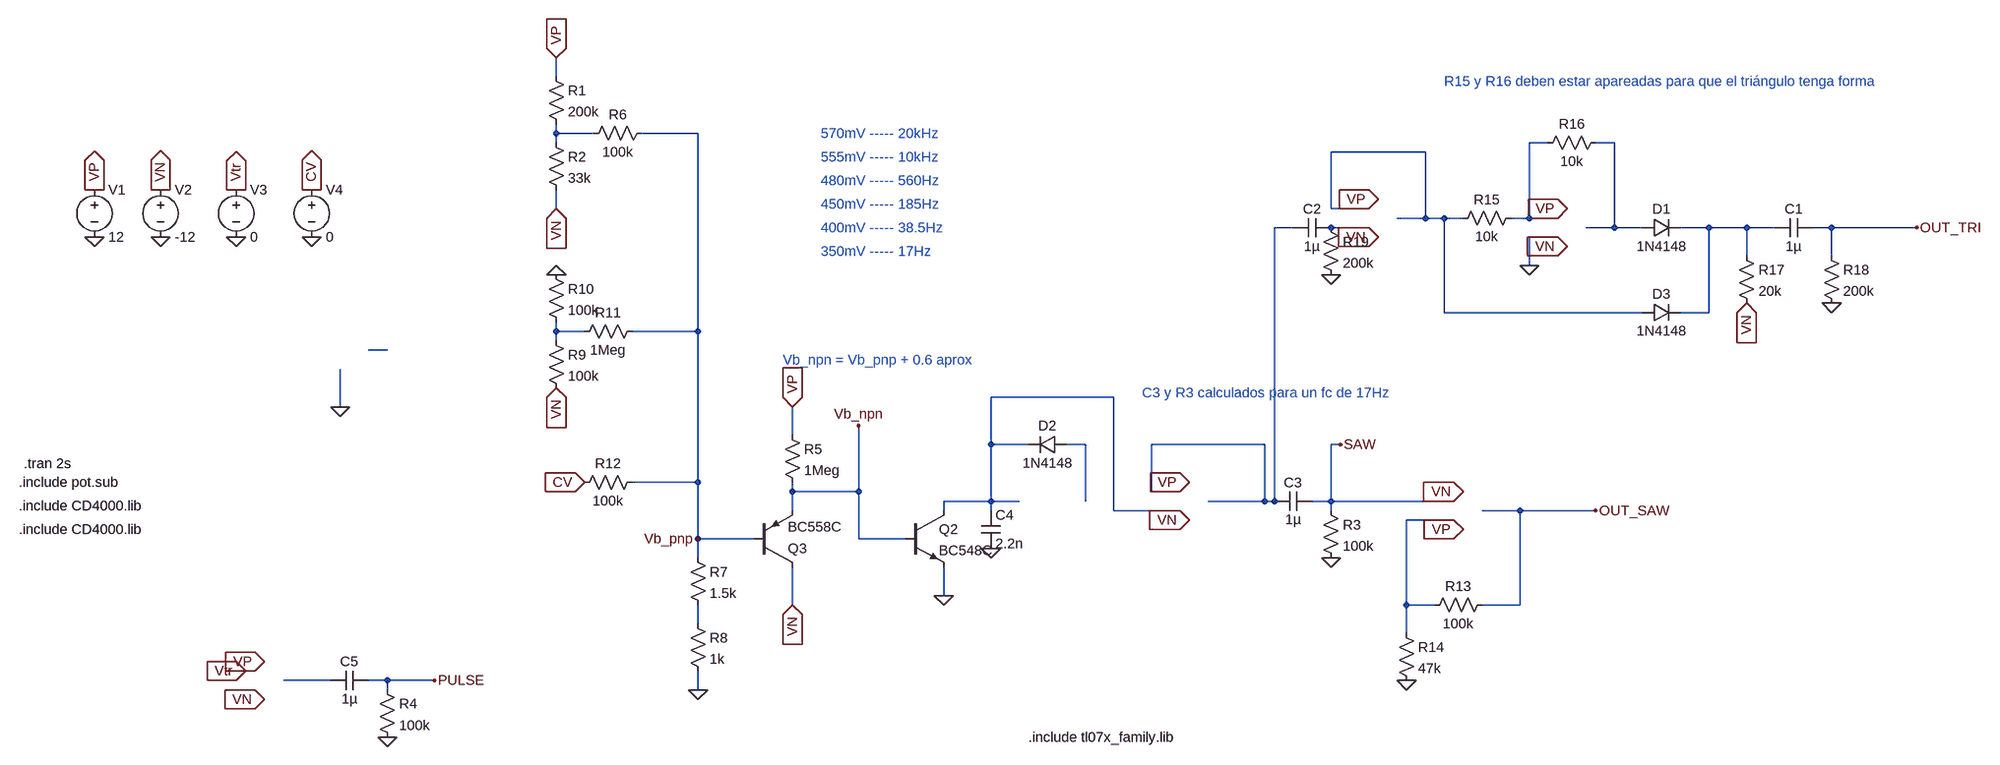
[diagram p0: schematic VCO_Osc2.asc]
VCO_Osc2.asc, the LTspice schematic file:
Version 4
SHEET 1 3176 680
WIRE 368 -960 368 -992
WIRE 368 -864 368 -880
WIRE 432 -864 368 -864
WIRE 608 -864 512 -864
WIRE 368 -848 368 -864
WIRE 2048 -848 2016 -848
WIRE 2160 -848 2128 -848
WIRE 1840 -832 1680 -832
WIRE 368 -736 368 -768
WIRE 1680 -736 1680 -832
WIRE 1728 -736 1680 -736
WIRE 1840 -720 1840 -832
WIRE 1840 -720 1792 -720
WIRE 1872 -720 1840 -720
WIRE 1904 -720 1872 -720
WIRE 2016 -720 2016 -848
WIRE 2016 -720 1984 -720
WIRE 2048 -720 2016 -720
WIRE 1616 -704 1584 -704
WIRE 1728 -704 1680 -704
WIRE 2160 -704 2160 -848
WIRE 2160 -704 2112 -704
WIRE 2208 -704 2160 -704
WIRE 2320 -704 2272 -704
WIRE 2384 -704 2320 -704
WIRE 2432 -704 2384 -704
WIRE 2528 -704 2496 -704
WIRE 2672 -704 2528 -704
WIRE 2048 -688 2016 -688
WIRE 2384 -656 2384 -704
WIRE 2528 -656 2528 -704
WIRE 2016 -640 2016 -688
WIRE 1872 -560 1872 -720
WIRE 2208 -560 1872 -560
WIRE 2320 -560 2320 -704
WIRE 2320 -560 2272 -560
WIRE 368 -528 368 -544
WIRE 416 -528 368 -528
WIRE 608 -528 608 -864
WIRE 608 -528 496 -528
WIRE 368 -512 368 -528
WIRE 80 -496 48 -496
WIRE 1312 -416 1104 -416
WIRE 0 -400 0 -464
WIRE 768 -352 768 -400
WIRE 1104 -336 1104 -416
WIRE 1168 -336 1104 -336
WIRE 1264 -336 1232 -336
WIRE 1568 -336 1376 -336
WIRE 1696 -336 1680 -336
WIRE 608 -272 608 -528
WIRE 608 -272 496 -272
WIRE 768 -256 768 -272
WIRE 880 -256 880 -368
WIRE 880 -256 768 -256
WIRE 1376 -256 1376 -336
WIRE 1408 -256 1376 -256
WIRE 1104 -240 1104 -336
WIRE 1104 -240 1024 -240
WIRE 1152 -240 1104 -240
WIRE 1264 -240 1264 -336
WIRE 1568 -240 1568 -336
WIRE 1568 -240 1472 -240
WIRE 1584 -240 1584 -704
WIRE 1584 -240 1568 -240
WIRE 1680 -240 1680 -336
WIRE 1680 -240 1648 -240
WIRE 1872 -240 1680 -240
WIRE 768 -224 768 -256
WIRE 1024 -224 1024 -240
WIRE 1104 -224 1104 -240
WIRE 1312 -224 1312 -416
WIRE 1408 -224 1312 -224
WIRE 1680 -224 1680 -240
WIRE 2000 -224 1936 -224
WIRE 2128 -224 2000 -224
WIRE 1872 -208 1808 -208
WIRE 608 -176 608 -272
WIRE 704 -176 608 -176
WIRE 880 -176 880 -256
WIRE 960 -176 880 -176
WIRE 608 -144 608 -176
WIRE 1024 -80 1024 -128
WIRE 768 -64 768 -128
WIRE 1808 -64 1808 -208
WIRE 1856 -64 1808 -64
WIRE 2000 -64 2000 -224
WIRE 2000 -64 1936 -64
WIRE 608 -32 608 -64
WIRE 1808 -16 1808 -64
WIRE -16 64 -96 64
WIRE 80 64 48 64
WIRE 160 64 80 64
WIRE 80 80 80 64
WIRE 608 80 608 48
FLAG -416 -688 0
FLAG -304 -688 0
FLAG -416 -768 VP
IOPIN -416 -768 Out
FLAG -304 -768 VN
IOPIN -304 -768 Out
FLAG -176 -688 0
FLAG -176 -768 Vtr
IOPIN -176 -768 Out
FLAG 1440 -272 VP
IOPIN 1440 -272 In
FLAG 1440 -208 VN
IOPIN 1440 -208 In
FLAG 1680 -144 0
FLAG 1024 -80 0
FLAG 1104 -160 0
FLAG 0 -400 0
FLAG 1696 -336 SAW
FLAG -128 32 VP
IOPIN -128 32 In
FLAG -128 96 VN
IOPIN -128 96 In
FLAG 160 64 PULSE
FLAG -160 48 Vtr
IOPIN -160 48 In
FLAG 80 160 0
FLAG 768 -64 VN
IOPIN 768 -64 In
FLAG 768 -400 VP
IOPIN 768 -400 In
FLAG 608 80 0
FLAG 368 -992 VP
IOPIN 368 -992 In
FLAG 368 -736 VN
IOPIN 368 -736 In
FLAG 368 -432 VN
IOPIN 368 -432 In
FLAG 368 -624 0
FLAG -48 -688 0
FLAG -48 -768 CV
IOPIN -48 -768 Out
FLAG 416 -272 CV
IOPIN 416 -272 In
FLAG 608 -176 Vb_pnp
FLAG 880 -368 Vb_npn
FLAG 1904 -192 VP
IOPIN 1904 -192 In
FLAG 1904 -256 VN
IOPIN 1904 -256 In
FLAG 1808 64 0
FLAG 2128 -224 OUT_SAW
FLAG 2080 -672 VN
IOPIN 2080 -672 In
FLAG 1760 -688 VN
IOPIN 1760 -688 In
FLAG 1760 -752 VP
IOPIN 1760 -752 In
FLAG 2080 -736 VP
IOPIN 2080 -736 In
FLAG 2016 -640 0
FLAG 2384 -576 VN
IOPIN 2384 -576 In
FLAG 2528 -576 0
FLAG 2672 -704 OUT_TRI
FLAG 1680 -624 0
SYMBOL voltage -416 -784 R0
WINDOW 123 0 0 Left 0
WINDOW 39 0 0 Left 0
SYMATTR InstName V1
SYMATTR Value 12
SYMBOL voltage -304 -784 R0
WINDOW 123 0 0 Left 0
WINDOW 39 0 0 Left 0
SYMATTR InstName V2
SYMATTR Value -12
SYMBOL voltage -176 -784 R0
WINDOW 123 0 0 Left 0
WINDOW 39 0 0 Left 0
SYMATTR InstName V3
SYMATTR Value 0
SYMBOL cap 1648 -256 R90
WINDOW 0 0 32 VBottom 2
WINDOW 3 32 32 VTop 2
SYMATTR InstName C3
SYMATTR Value 1µ
SYMBOL res 1664 -240 R0
SYMATTR InstName R3
SYMATTR Value 100k
SYMBOL cap 1088 -224 R0
SYMATTR InstName C4
SYMATTR Value 2.2n
SYMBOL diode 1232 -352 R90
WINDOW 0 0 32 VBottom 2
WINDOW 3 32 32 VTop 2
SYMATTR InstName D2
SYMATTR Value 1N4148
SYMBOL npn 960 -224 R0
SYMATTR InstName Q2
SYMATTR Value BC548C
SYMBOL cap 48 48 R90
WINDOW 0 0 32 VBottom 2
WINDOW 3 32 32 VTop 2
SYMATTR InstName C5
SYMATTR Value 1µ
SYMBOL res 64 64 R0
SYMATTR InstName R4
SYMATTR Value 100k
SYMBOL pnp 704 -128 M180
SYMATTR InstName Q3
SYMATTR Value BC558C
SYMBOL res 752 -368 R0
SYMATTR InstName R5
SYMATTR Value 1Meg
SYMBOL res 352 -976 R0
SYMATTR InstName R1
SYMATTR Value 200k
SYMBOL res 352 -864 R0
SYMATTR InstName R2
SYMATTR Value 33k
SYMBOL res 528 -880 R90
WINDOW 0 0 56 VBottom 2
WINDOW 3 32 56 VTop 2
SYMATTR InstName R6
SYMATTR Value 100k
SYMBOL res 592 -160 R0
SYMATTR InstName R7
SYMATTR Value 1.5k
SYMBOL res 592 -48 R0
SYMATTR InstName R8
SYMATTR Value 1k
SYMBOL res 352 -528 R0
SYMATTR InstName R9
SYMATTR Value 100k
SYMBOL res 352 -640 R0
SYMATTR InstName R10
SYMATTR Value 100k
SYMBOL res 512 -544 R90
WINDOW 0 0 56 VBottom 2
WINDOW 3 32 56 VTop 2
SYMATTR InstName R11
SYMATTR Value 1Meg
SYMBOL voltage -48 -784 R0
WINDOW 123 0 0 Left 0
WINDOW 39 0 0 Left 0
SYMATTR InstName V4
SYMATTR Value 0
SYMBOL res 512 -288 R90
WINDOW 0 0 56 VBottom 2
WINDOW 3 32 56 VTop 2
SYMATTR InstName R12
SYMATTR Value 100k
SYMBOL res 1952 -80 R90
WINDOW 0 0 56 VBottom 2
WINDOW 3 32 56 VTop 2
SYMATTR InstName R13
SYMATTR Value 100k
SYMBOL res 1792 -32 R0
SYMATTR InstName R14
SYMATTR Value 47k
SYMBOL res 2000 -736 R90
WINDOW 0 0 56 VBottom 2
WINDOW 3 32 56 VTop 2
SYMATTR InstName R15
SYMATTR Value 10k
SYMBOL res 2144 -864 R90
WINDOW 0 0 56 VBottom 2
WINDOW 3 32 56 VTop 2
SYMATTR InstName R16
SYMATTR Value 10k
SYMBOL diode 2208 -688 R270
WINDOW 0 32 32 VTop 2
WINDOW 3 0 32 VBottom 2
SYMATTR InstName D1
SYMATTR Value 1N4148
SYMBOL diode 2208 -544 R270
WINDOW 0 32 32 VTop 2
WINDOW 3 0 32 VBottom 2
SYMATTR InstName D3
SYMATTR Value 1N4148
SYMBOL res 2368 -672 R0
SYMATTR InstName R17
SYMATTR Value 20k
SYMBOL res 2512 -672 R0
SYMATTR InstName R18
SYMATTR Value 200k
SYMBOL cap 2496 -720 R90
WINDOW 0 0 32 VBottom 2
WINDOW 3 32 32 VTop 2
SYMATTR InstName C1
SYMATTR Value 1µ
SYMBOL res 1664 -720 R0
SYMATTR InstName R19
SYMATTR Value 200k
SYMBOL cap 1680 -720 R90
WINDOW 0 0 32 VBottom 2
WINDOW 3 32 32 VTop 2
SYMATTR InstName C2
SYMATTR Value 1µ
TEXT -536 -304 Left 2 !.tran 2s
TEXT -544 -232 Left 2 !.include CD4000.lib
TEXT -544 -192 Left 2 !.include CD4000.lib
TEXT -544 -272 Left 2 !.include pot.sub
TEXT 816 -864 Left 2 ;570mV ----- 20kHz
TEXT 816 -824 Left 2 ;555mV ----- 10kHz
TEXT 816 -784 Left 2 ;480mV ----- 560Hz
TEXT 816 -744 Left 2 ;450mV ----- 185Hz
TEXT 816 -704 Left 2 ;400mV ----- 38.5Hz
TEXT 816 -664 Left 2 ;350mV ----- 17Hz
TEXT 1360 -424 Left 2 ;C3 y R3 calculados para un fc de 17Hz
TEXT 752 -480 Left 2 ;Vb_npn = Vb_pnp + 0.6 aprox
TEXT 1872 -952 Left 2 ;R15 y R16 deben estar apareadas para que el triángulo tenga forma
TEXT 1168 160 Left 2 !.include tl07x_family.lib

The netlist it stands for:
* VCO_Osc2.asc
V1 VP 0 12
V2 VN 0 -12
V3 Vtr 0 0
C3 SAW N005 1µ
R3 SAW 0 100k
C4 N010 0 2.2n
D2 N011 N010 1N4148
Q2 N010 Vb_npn 0 0 BC548C
C5 PULSE N014 1µ
R4 PULSE 0 100k
Q3 VN Vb_pnp Vb_npn 0 BC558C
R5 VP Vb_npn 1Meg
R1 VP N001 200k
R2 N001 VN 33k
R6 Vb_pnp N001 100k
R7 Vb_pnp N013 1.5k
R8 N013 0 1k
R9 N008 VN 100k
R10 0 N008 100k
R11 Vb_pnp N008 1Meg
V4 CV 0 0
R12 Vb_pnp CV 100k
R13 OUT_SAW N012 100k
R14 N012 0 47k
R15 N002 N004 10k
R16 N003 N002 10k
D1 N003 N007 1N4148
D3 N004 N007 1N4148
R17 N007 VN 20k
R18 OUT_TRI 0 200k
C1 OUT_TRI N007 1µ
R19 N006 0 200k
C2 N006 N005 1µ
.model D D
.lib standard.dio
.model NPN NPN
.model PNP PNP
.lib standard.bjt
.tran 2s
.include CD4000.lib
.include CD4000.lib
.include pot.sub
* 570mV ----- 20kHz
* 555mV ----- 10kHz
* 480mV ----- 560Hz
* 450mV ----- 185Hz
* 400mV ----- 38.5Hz
* 350mV ----- 17Hz
* C3 y R3 calculados para un fc de 17Hz
* Vb_npn = Vb_pnp + 0.6 aprox
* R15 y R16 deben estar apareadas para que el triángulo tenga forma
.include tl07x_family.lib
.backanno
.end